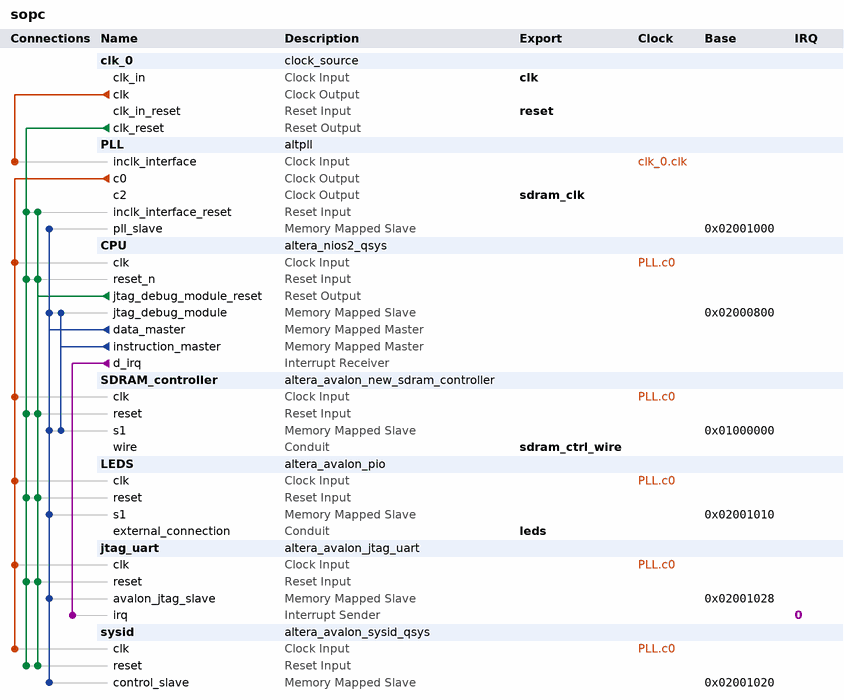
[diagram p0: system contents]
# Platform Designer (Qsys) system sopc, Cyclone IV E EP4CE30F23C7
# Parameters at their usual value, and those the tool derives, are not listed.
package require -exact qsys 15.1
create_system sopc
set_project_property DEVICE_FAMILY {Cyclone IV E}
set_project_property DEVICE EP4CE30F23C7

add_instance clk_0 clock_source 15.1
set_instance_parameter_value clk_0 clockFrequency 50000000

add_instance PLL altpll 15.1
set_instance_parameter_value PLL CLK0_DIVIDE_BY 1
set_instance_parameter_value PLL CLK0_MULTIPLY_BY 1
set_instance_parameter_value PLL CLK2_DIVIDE_BY 1
set_instance_parameter_value PLL CLK2_DUTY_CYCLE 50
set_instance_parameter_value PLL CLK2_MULTIPLY_BY 1
set_instance_parameter_value PLL CLK2_PHASE_SHIFT 0
set_instance_parameter_value PLL INCLK0_INPUT_FREQUENCY 20000
set_instance_parameter_value PLL PORT_ARESET PORT_UNUSED
set_instance_parameter_value PLL PORT_LOCKED PORT_UNUSED
set_instance_parameter_value PLL PORT_clk1 PORT_UNUSED
set_instance_parameter_value PLL PORT_clk2 PORT_USED
set_instance_parameter_value PLL PORT_clk3 PORT_UNUSED

add_instance CPU altera_nios2_qsys 15.1
set_instance_parameter_value CPU breakSlave CPU.jtag_debug_module
set_instance_parameter_value CPU exceptionSlave SDRAM_controller.s1
set_instance_parameter_value CPU icache_size 4096
set_instance_parameter_value CPU impl Fast
set_instance_parameter_value CPU mmu_TLBMissExcSlave None
set_instance_parameter_value CPU resetSlave SDRAM_controller.s1
set_instance_parameter_value CPU resetrequest_enabled true

add_instance SDRAM_controller altera_avalon_new_sdram_controller 15.1
set_instance_parameter_value SDRAM_controller TAC 5.5
set_instance_parameter_value SDRAM_controller TRCD 20.0
set_instance_parameter_value SDRAM_controller TRP 20.0
set_instance_parameter_value SDRAM_controller casLatency 3
set_instance_parameter_value SDRAM_controller columnWidth 9
set_instance_parameter_value SDRAM_controller dataWidth 16
set_instance_parameter_value SDRAM_controller generateSimulationModel false
set_instance_parameter_value SDRAM_controller model single_Micron_MT48LC4M32B2_7_chip
set_instance_parameter_value SDRAM_controller numberOfBanks 4
set_instance_parameter_value SDRAM_controller numberOfChipSelects 1
set_instance_parameter_value SDRAM_controller powerUpDelay 100.0
set_instance_parameter_value SDRAM_controller refreshPeriod 15.625
set_instance_parameter_value SDRAM_controller rowWidth 12

add_instance LEDS altera_avalon_pio 15.1
set_instance_parameter_value LEDS direction Output
set_instance_parameter_value LEDS width 8

add_instance jtag_uart altera_avalon_jtag_uart 15.1
set_instance_parameter_value jtag_uart simInteractiveOptions NO_INTERACTIVE_WINDOWS

add_instance sysid altera_avalon_sysid_qsys 15.1
set_instance_parameter_value sysid id 0

# connections
add_connection clk_0.clk PLL.inclk_interface clock
add_connection PLL.c0 CPU.clk clock
add_connection PLL.c0 jtag_uart.clk clock
add_connection PLL.c0 LEDS.clk clock
add_connection PLL.c0 SDRAM_controller.clk clock
add_connection PLL.c0 sysid.clk clock
add_connection clk_0.clk_reset CPU.reset_n reset
add_connection clk_0.clk_reset jtag_uart.reset reset
add_connection clk_0.clk_reset LEDS.reset reset
add_connection clk_0.clk_reset PLL.inclk_interface_reset reset
add_connection clk_0.clk_reset SDRAM_controller.reset reset
add_connection clk_0.clk_reset sysid.reset reset
add_connection CPU.jtag_debug_module_reset CPU.reset_n reset
add_connection CPU.jtag_debug_module_reset jtag_uart.reset reset
add_connection CPU.jtag_debug_module_reset LEDS.reset reset
add_connection CPU.jtag_debug_module_reset PLL.inclk_interface_reset reset
add_connection CPU.jtag_debug_module_reset SDRAM_controller.reset reset
add_connection CPU.jtag_debug_module_reset sysid.reset reset
add_connection CPU.data_master CPU.jtag_debug_module avalon
set_connection_parameter_value CPU.data_master/CPU.jtag_debug_module baseAddress 0x02000800
add_connection CPU.data_master jtag_uart.avalon_jtag_slave avalon
set_connection_parameter_value CPU.data_master/jtag_uart.avalon_jtag_slave baseAddress 0x02001028
add_connection CPU.data_master LEDS.s1 avalon
set_connection_parameter_value CPU.data_master/LEDS.s1 baseAddress 0x02001010
add_connection CPU.data_master PLL.pll_slave avalon
set_connection_parameter_value CPU.data_master/PLL.pll_slave baseAddress 0x02001000
add_connection CPU.data_master SDRAM_controller.s1 avalon
set_connection_parameter_value CPU.data_master/SDRAM_controller.s1 baseAddress 0x01000000
add_connection CPU.data_master sysid.control_slave avalon
set_connection_parameter_value CPU.data_master/sysid.control_slave baseAddress 0x02001020
add_connection CPU.instruction_master CPU.jtag_debug_module avalon
set_connection_parameter_value CPU.instruction_master/CPU.jtag_debug_module baseAddress 0x02000800
add_connection CPU.instruction_master SDRAM_controller.s1 avalon
set_connection_parameter_value CPU.instruction_master/SDRAM_controller.s1 baseAddress 0x01000000
add_connection CPU.d_irq jtag_uart.irq interrupt
set_connection_parameter_value CPU.d_irq/jtag_uart.irq irqNumber 0

# exported interfaces
add_interface clk clock sink
set_interface_property clk EXPORT_OF clk_0.clk_in
add_interface leds conduit end
set_interface_property leds EXPORT_OF LEDS.external_connection
add_interface reset reset sink
set_interface_property reset EXPORT_OF clk_0.clk_in_reset
add_interface sdram_clk clock source
set_interface_property sdram_clk EXPORT_OF PLL.c2
add_interface sdram_ctrl_wire conduit end
set_interface_property sdram_ctrl_wire EXPORT_OF SDRAM_controller.wire

set_interconnect_requirement {$system} qsys_mm.clockCrossingAdapter HANDSHAKE
set_interconnect_requirement {$system} qsys_mm.enableEccProtection FALSE
set_interconnect_requirement {$system} qsys_mm.insertDefaultSlave FALSE
set_interconnect_requirement {$system} qsys_mm.maxAdditionalLatency 1

save_system sopc.qsys
